# EasyEDA Pro project UWB_&_Sensor_Extension_Board.eprj

# Schematic Schematic1
Board Name: Board1; Create Date: 2026-06-23; Page Name: P1; Project Name: UWB_&_Sensor_Extension_Board; Schematic Name: Schematic1; Update Date: 2026-07-01; Company: EasyEDA.com; Page Size: A4; Version: V1.0
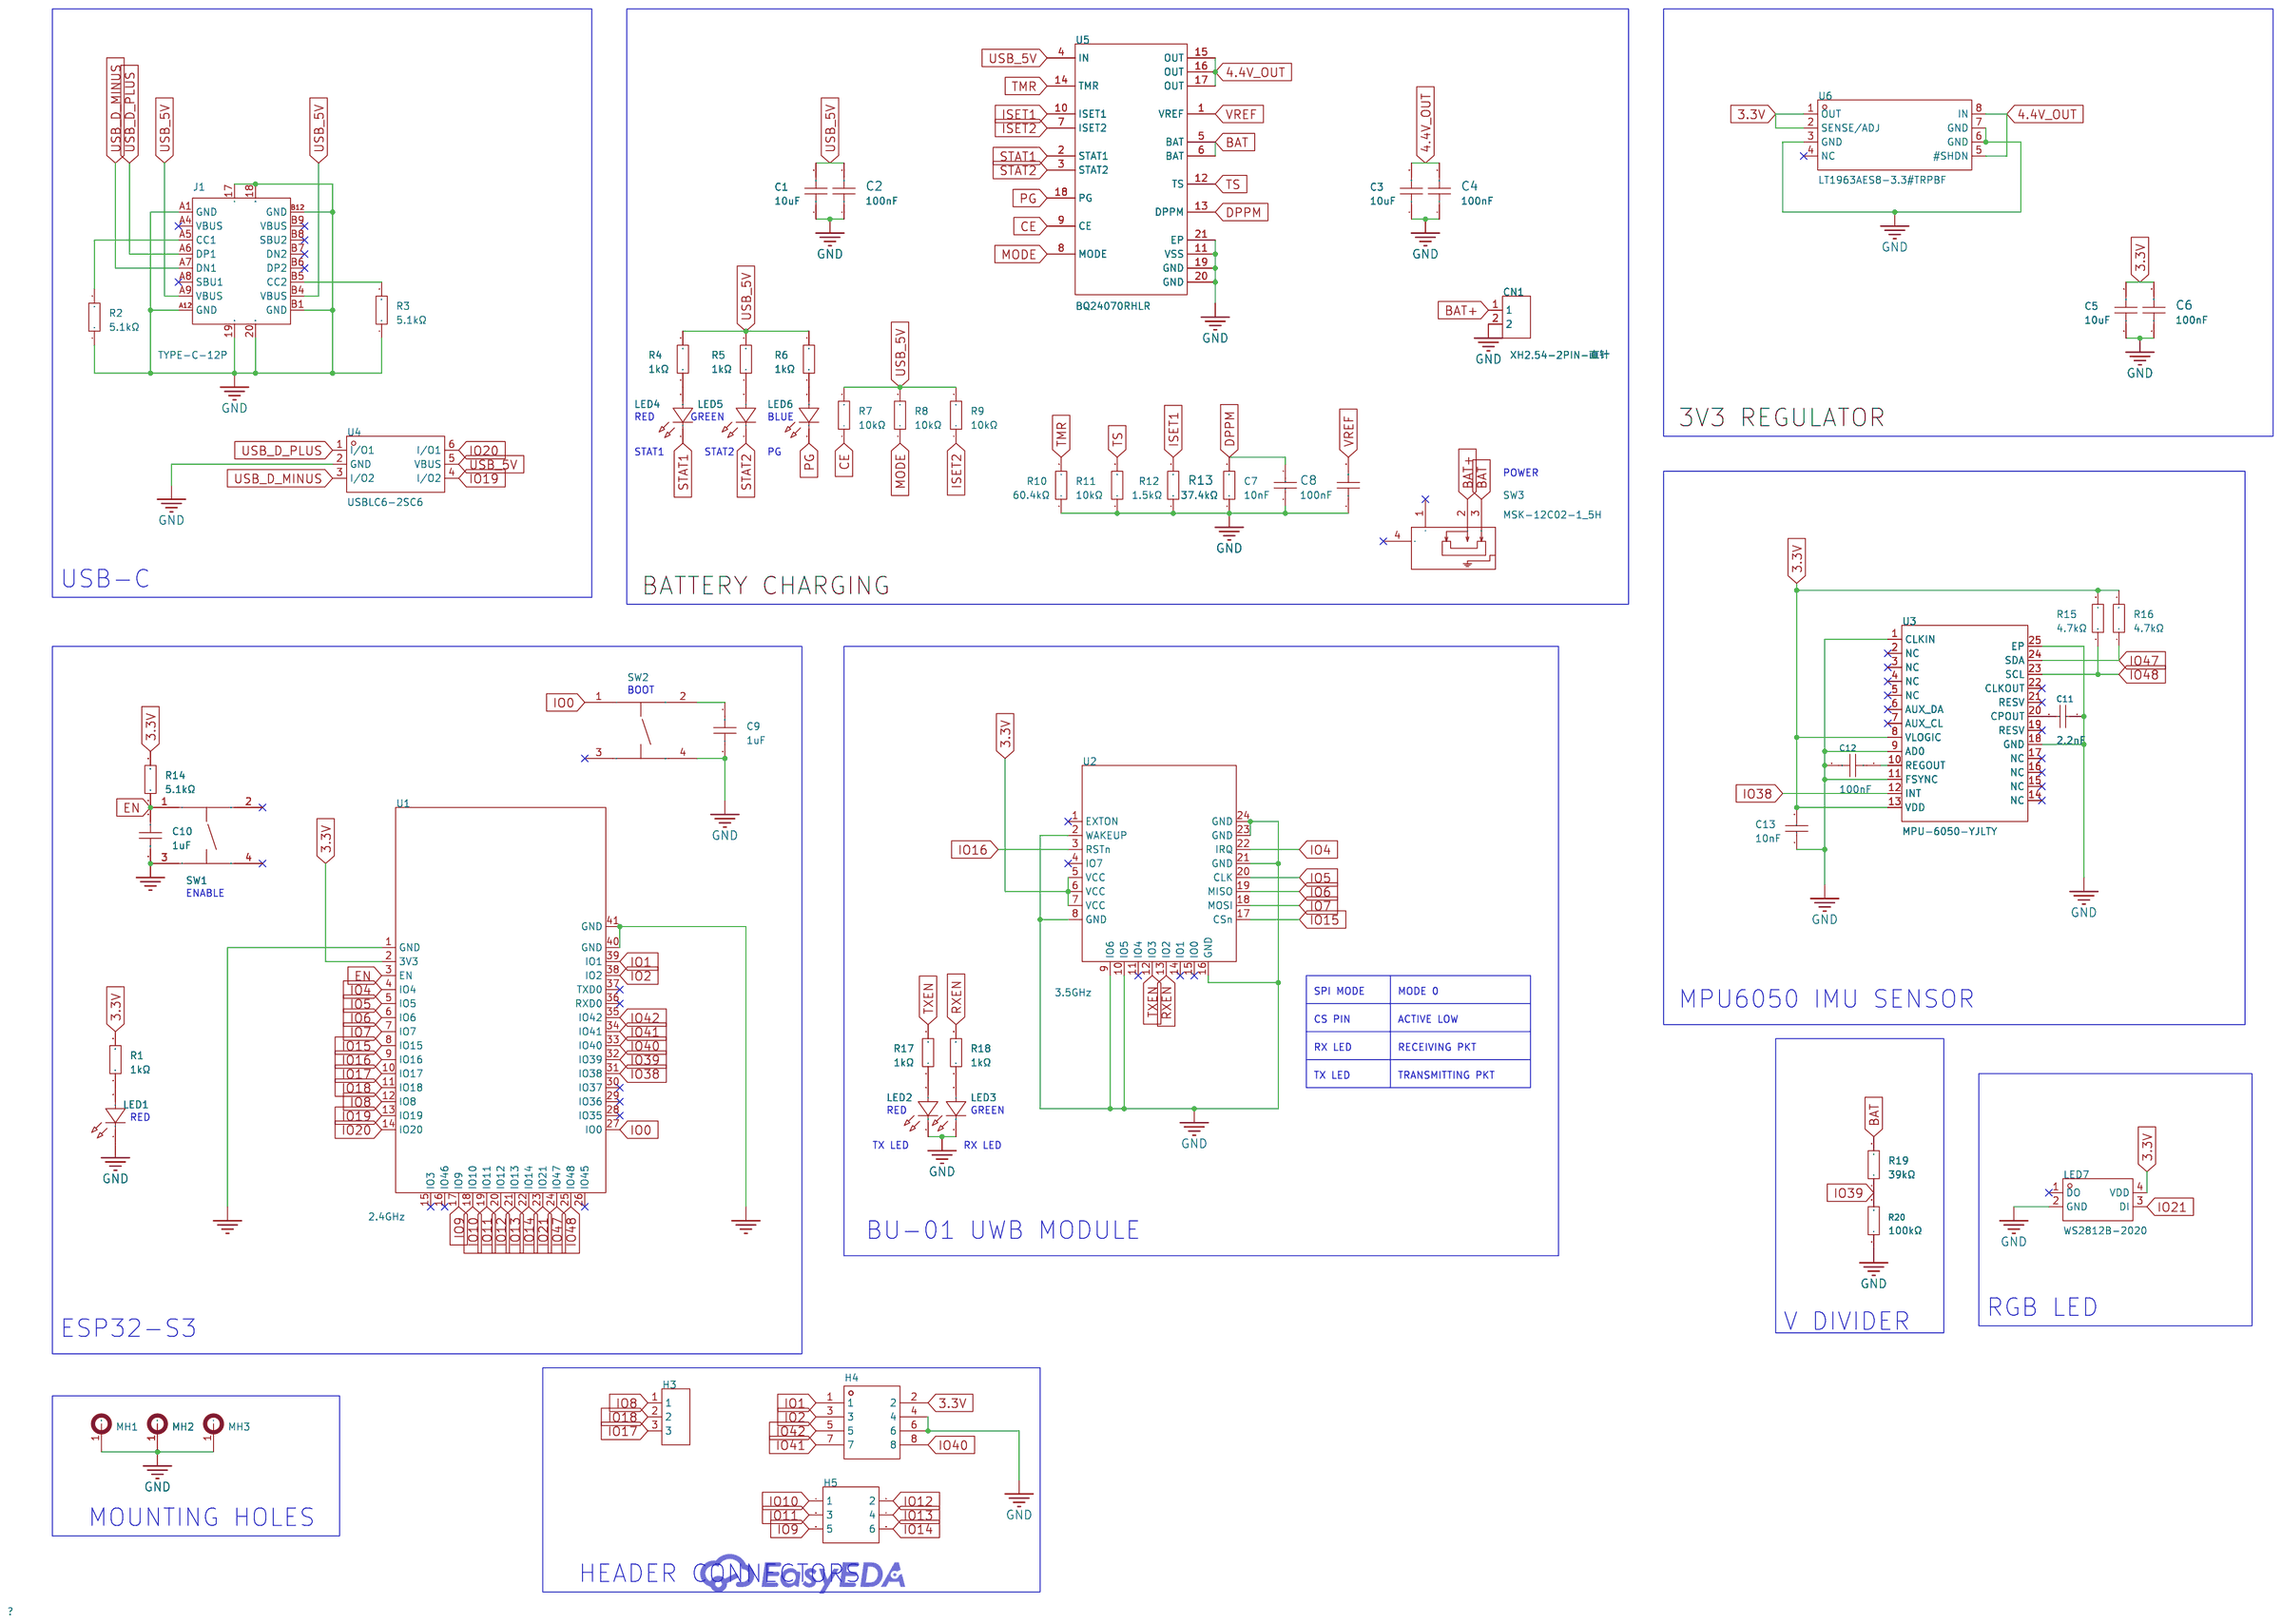
[diagram p0: schematic sheet]

## Parts
C1  10uF  [C0603]
C2  100nF  [C0603]
C3  10uF  [C0603]
C4  100nF  [C0603]
C5  10uF  [C0603]
C6  100nF  [C0603]
C7  10nF  [C0603]
C8  100nF  [C0603]
C9  1uF  [C0603]
C10  1uF  [C0603]
C11  2.2nF  [C0603]
C12  100nF  [C0603]
C13  10nF  [C0603]
CN1  XH2.54-2PIN-直针  [CONN-TH_XH2.54-2P]
H3  -  [HDR-TH_3P-P2.54-V-M]
H4  -  [HDR-TH_8P-P2.54-V-M-R2-C4-S2.54]
H5  -  [HDR-TH_6P-P2.54-V-R2-C3-S2.54_A2541WV-2X3P]
J1  TYPE-C-12P  [USB-SMD_TYPE-C16PIN]
LED1  19-217/GHC-YR1S2/6T  [LED0603-RD_GREEN]
LED2  19-217/GHC-YR1S2/6T  [LED0603-RD_GREEN]
LED3  19-217/GHC-YR1S2/6T  [LED0603-RD_GREEN]
LED4  19-217/GHC-YR1S2/6T  [LED0603-RD_GREEN]
LED5  19-217/GHC-YR1S2/6T  [LED0603-RD_GREEN]
LED6  19-217/GHC-YR1S2/6T  [LED0603-RD_GREEN]
LED7  WS2812B-2020  [LED-SMD_4P-L2.0-W2.0-TL_WS2812B-2020]
MH1  -  [MH_7.5x2.7mm]  (no BOM)
MH2  -  [MH_7.5x2.7mm]  (no BOM)
MH3  -  [MH_7.5x2.7mm]  (no BOM)
R1  1kΩ  [R0603]
R2  5.1kΩ  [R0603]
R3  5.1kΩ  [R0603]
R4  1kΩ  [R0603]
R5  1kΩ  [R0603]
R6  1kΩ  [R0603]
R7  10kΩ  [R0603]
R8  10kΩ  [R0603]
R9  10kΩ  [R0603]
R10  60.4kΩ  [R0603]
R11  10kΩ  [R0603]
R12  1.5kΩ  [R0603]
R13  37.4kΩ  [R0603]
R14  5.1kΩ  [R0603]
R15  4.7kΩ  [R0603]
R16  4.7kΩ  [R0603]
R17  1kΩ  [R0603]
R18  1kΩ  [R0603]
R19  39kΩ  [R0603]
R20  100kΩ  [R0603]
SW1  TS3315A  [SW-SMD_4P-L3.4-W3.4-P2.00-LS4.0]
SW2  TS3315A  [SW-SMD_4P-L3.4-W3.4-P2.00-LS4.0]
SW3  MSK-12C02-1_5H  [SW-TH_MSK12C02]
U1  2.4GHz  [WIRELM-SMD_ESP32-S3-WROOM-1]
U2  3.5GHz  [COMM-SMD_BU01]
U3  MPU-6050-YJLTY  [QFN-24_L4.0-W4.0-P0.50-TL-EP2.7]
U4  USBLC6-2SC6  [SOT-23-6_L2.9-W1.6-P0.95-LS2.8-BL]
U5  BQ24070RHLR  [QFN-20_L4.7-W3.7-P0.50-BL-EP]
U6  LT1963AES8-3.3#TRPBF  [SO-8_L4.9-W3.9-P1.27-LS5.9-BL]

## Library data of the parts
C1 C3 C5 = CL10A106KP8NNNC: Capacitance:10uF Tolerance:±10% Tolerance:±10% Voltage Rating:10V Temperature Coefficient:X5R; LCSC Part Name: 10uF ±10% 10V; Supplier Part: C19702; Manufacturer: SAMSUNG(三星); Supplier Footprint: 0603; JLCPCB Part Class: Basic Part; Datasheet: https://item.szlcsc.com/datasheet/CL10A106KP8NNNC/20411.html; Supplier: LCSC; Tolerance: ±10%; Voltage Rating: 10V; Temperature Coefficient: X5R
C2 C4 C6 C8 C12 = CC0603KRX7R6BB104: Capacitance:100nF Tolerance:±10% Tolerance:±10% Voltage Rating:10V Temperature Coefficient:X7R; LCSC Part Name: 100nF ±10% 10V; Supplier Part: C519438; Manufacturer: YAGEO(国巨); Supplier Footprint: 0603; JLCPCB Part Class: Extended Part; Datasheet: https://item.szlcsc.com/datasheet/CC0603KRX7R6BB104/536109.html; Supplier: LCSC; Tolerance: ±10%; Voltage Rating: 10V; Temperature Coefficient: X7R
C7 C13 = CC0603JRX7R9BB103: LCSC Part Name: 10nF ±5% 50V; Supplier Part: C115056; Manufacturer: YAGEO(国巨); Supplier Footprint: 0603; Datasheet: https://item.szlcsc.com/datasheet/CC0603JRX7R9BB103/116301.html; Supplier: LCSC; Tolerance: ±5%; Voltage Rating: 50V; Temperature Coefficient: X7R
C9 C10 = 0603X105K250CT: Capacitance: Tolerance:±10% Tolerance:±10% Voltage Rated: Temperature Coefficient:; LCSC Part Name: 1uF ±10% 25V; Supplier Part: C303883; Manufacturer: Walsin(华新科); Supplier Footprint: 0603; Supplier: LCSC; Tolerance: ±10%
C11 = CC0603JRNPO9BN222: LCSC Part Name: 2.2nF ±5% 50V; Supplier Part: C107043; Manufacturer: YAGEO(国巨); Supplier Footprint: 0603; JLCPCB Part Class: Extended Part; Datasheet: https://item.szlcsc.com/datasheet/CC0603JRNPO9BN222/108259.html; Supplier: LCSC; Tolerance: ±5%; Voltage Rating: 50V; Temperature Coefficient: NP0
CN1 = XH2.54-2PIN-直针: Supplier Part: C9900011425; Supplier Footprint: XH2.54-2PIN; Supplier: LCSC
H3 = HDR-M_2.54_1x3P: Supplier Footprint: Through
H4 = HDR-M_2.54_2x4: Supplier Footprint: Through
H5 = HDR-M_2.54_2x3: Supplier Footprint: Through
J1 = TYPE-C-12P: Supplier Part: C9900014866; Supplier Footprint: USB_TypeC; JLCPCB Part Class: Extended Part; Supplier: LCSC
LED1-LED6 = 19-217/GHC-YR1S2/6T: Lamp Holder Type:- Illumination Color:Emerald Voltage - Forward(Vf):- Voltage - Forward(Vf):- Power(Watts):- Forward Current:- Wavelength - Dominant:- Wavelength - Dominant:- Peak Wavelength:- Diode Configuration:- Lens Color:- Color Temperature:- Color T; LCSC Part Name: 翠绿; Supplier Part: C2986059; Manufacturer: EVERLIGHT(亿光); Supplier Footprint: 0603; Supplier: LCSC; Illumination Color: Emerald
LED7 = WS2812B-2020: LCSC Part Name: RGB三色 停产; Supplier Part: C965555; Manufacturer: worldsemi; Supplier Footprint: SMD,2.2x2mm; JLCPCB Part Class: Extended Part; Datasheet: https://item.szlcsc.com/datasheet/WS2812B-2020/1051115.html; Supplier: LCSC; Wavelength: G:515.6nm；R:622.5nm；B:470.4nm; Luminous Intensity: 200mcd；160mcd；520mcd; Fixed-Frequency Pwm Mode: 2kHz; Data Transmission Rate: 800Kbit/s; Voltage - Supply: 5V; Installation method: Top-mount; Height: 0.84mm; Features: Built-in power-on reset circuit；Integrated intelligent reverse connection protection function；Built-in power-on reset circuit
MH1-MH3 = MH_7.5x2.7mm
R1 R4-R6 R17 R18 = RC0603FR-071KL: LCSC Part Name: 厚膜电阻 1kΩ ±1% 100mW; Supplier Part: C22548; Manufacturer: YAGEO(国巨); Supplier Footprint: 0603; JLCPCB Part Class: Extended Part; Datasheet: https://item.szlcsc.com/datasheet/RC0603FR-071KL/23274.html; Supplier: LCSC; Type: Thick Film Resistor; Tolerance: ±1%; Power(Watts): 100mW; Voltage-Supply(Max): 75V; Temperature Coefficient: ±100ppm/℃; Operating Temperature: -55℃~+155℃
R2 R3 R14 = RC0603FR-075K1L: Type:Thick Film Resistors Resistance:5.1kΩ Tolerance:±1% Tolerance:±1% Power(Watts):100mW Voltage-Supply(Max):75V Temperature Coefficient:±100ppm/℃ Temperature Coefficient:±100ppm/℃ Operating Temperature:-55℃~+155℃ Operating Temperature:-55℃~+155℃; LCSC Part Name: 厚膜电阻 5.1kΩ ±1% 100mW; Supplier Part: C105580; Manufacturer: YAGEO(国巨); Supplier Footprint: 0603; Datasheet: https://item.szlcsc.com/datasheet/RC0603FR-075K1L/106795.html; Supplier: LCSC; Type: Thick Film Resistors; Tolerance: ±1%; Power(Watts): 100mW; Voltage-Supply(Max): 75V; Temperature Coefficient: ±100ppm/℃; Operating Temperature: -55℃~+155℃
R7-R9 R11 = RC0603FR-0710KL: LCSC Part Name: 厚膜电阻 10kΩ ±1% 100mW; Supplier Part: C98220; Manufacturer: YAGEO(国巨); Supplier Footprint: 0603; JLCPCB Part Class: Extended Part; Datasheet: https://item.szlcsc.com/datasheet/RC0603FR-0710KL/99429.html; Supplier: LCSC; Type: Thick Film Resistor; Tolerance: ±1%; Power(Watts): 100mW; Voltage-Supply(Max): 75V; Temperature Coefficient: ±100ppm/℃; Operating Temperature: -55℃~+155℃
R10 = RC0603FR-0760K4L: LCSC Part Name: 厚膜电阻 60.4kΩ ±1% 100mW; Supplier Part: C165742; Manufacturer: YAGEO(国巨); Supplier Footprint: 0603; Datasheet: https://atta.szlcsc.com/upload/public/pdf/source/20190902/C165742_BA3296AC33DF48BC3358B1B621A03FC2.pdf; Supplier: LCSC; Type: Thick Film Resistors; Tolerance: ±1%; Temperature Coefficient: ±100ppm/℃; Operating Temperature Range: -55℃~+155℃
R12 = RC0603FR-071K5L: LCSC Part Name: 厚膜电阻 1.5kΩ ±1% 100mW; Supplier Part: C114668; Manufacturer: YAGEO(国巨); Supplier Footprint: 0603; JLCPCB Part Class: Extended Part; Datasheet: https://atta.szlcsc.com/upload/public/pdf/source/20180821/C275644_0D56F95EFF785E7D9A1FEF436B37DA78.pdf; Supplier: LCSC; Type: Thick Film Resistors; Tolerance: ±1%; Temperature Coefficient: ±100ppm/℃; Operating Temperature Range: -55℃~+155℃
R13 = 0603WAF3742T5E: LCSC Part Name: 37.4kΩ ±1% 100mW 厚膜电阻; Supplier Part: C23033; Manufacturer: UNI-ROYAL(厚声); Supplier Footprint: 0603; Datasheet: https://item.szlcsc.com/datasheet/0603WAF3742T5E/23760.html; Supplier: LCSC; Type: Thick Film Resistor; Tolerance: ±1%; Power(Watts): 100mW; Voltage-Supply(Max): 75V; Temperature Coefficient: ±100ppm/℃; Operating Temperature: -55℃~+155℃
R15 R16 = RC0603FR-074K7L: LCSC Part Name: 厚膜电阻 4.7kΩ ±1% 100mW; Supplier Part: C99782; Manufacturer: YAGEO(国巨); Supplier Footprint: 0603; Datasheet: https://item.szlcsc.com/datasheet/RC0603FR-074K7L/100996.html; Supplier: LCSC; Type: Thick Film Resistor; Tolerance: ±1%; Power(Watts): 100mW; Voltage-Supply(Max): 75V; Temperature Coefficient: ±100ppm/℃; Operating Temperature: -55℃~+155℃
R19 = RC0603FR-0739KL: LCSC Part Name: 厚膜电阻 39kΩ ±1% 100mW; Supplier Part: C163424; Manufacturer: YAGEO(国巨); Supplier Footprint: 0603; Datasheet: https://atta.szlcsc.com/upload/public/pdf/source/20181009/C309620_DA5935B6E1D48212CB7A533FE518B3C2.pdf; Supplier: LCSC; Type: Thick Film Resistors; Tolerance: ±1%; Temperature Coefficient: ±100ppm/℃; Operating Temperature Range: -55℃~+155℃
R20 = RC0603FR-07100KL: LCSC Part Name: 厚膜电阻 100kΩ ±1% 100mW; Supplier Part: C14675; Manufacturer: YAGEO(国巨); Supplier Footprint: 0603; JLCPCB Part Class: Extended Part; Datasheet: https://atta.szlcsc.com/upload/public/pdf/source/20140324/1457707028752.pdf; Supplier: LCSC; Type: Thick Film Resistors; Tolerance: ±1%; Temperature Coefficient: ±100ppm/℃; Operating Temperature Range: -55℃~+155℃
SW1 SW2 = TS3315A: Circuit:SPST Actuator Style:Round Button Operating Force:2.5N Mounting Type:Surface Mount,Vertical Length:3.3mm Width:3.3mm Switch Height:1.5mm with Bracket:Without Bracket Contact Current:50mA Voltage Rating:12V Actuator/Cap Color:Black With Lamp:No IP R; LCSC Part Name: 3.3*3.3*1.5mm 立贴 轻触开关; Supplier Part: C412367; Manufacturer: SHOU HAN(首韩); Supplier Footprint: SMD,3.3x3.3mm; Datasheet: https://item.szlcsc.com/datasheet/TS3315A/404079.html; Supplier: LCSC; Circuit: SPST; Actuator Style: Round Button; Operating Force: 2.5N; Mounting Type: Surface Mount,Vertical; Length: 3.3mm; Width: 3.3mm; Switch Height: 1.5mm; with Bracket: Without Bracket; Contact Current: 50mA; Voltage Rating: 12V; Actuator/Cap Color: Black; With Lamp: No; Termination Style: SMD(SMT) Tab; Life: 50,000 cycles; Operating Temperature: -20℃~+70℃
SW3 = MSK-12C02-1_5H: Supplier Part: C9900018305; JLCPCB Part Class: Extended Part; Supplier: LCSC
U1 = ESP32-S3-WROOM-1-N16R8: Utilized IC / Part:ESP32-S3R8 Interface Type:I2C；GPIO；UART；SPI；USB；I2S Frequency:2.4GHz Antenna Type:On-board PCB Antenna Output Power:20.5dBm Output Power:20.5dBm Voltage - Supply:3V~3.6V Voltage - Supply:3V~3.6V Receive  Current:95mA Send  Current:355mA; LCSC Part Name: 不带固件 通用型Wi-Fi+低功耗蓝牙MCU模组; Supplier Part: C2913202; Manufacturer: ESPRESSIF(乐鑫); Supplier Footprint: SMD,25.5x18mm; JLCPCB Part Class: Extended Part; Datasheet: https://item.szlcsc.com/datasheet/ESP32-S3-WROOM-1-N16R8/3198300.html; Supplier: LCSC; Utilized IC / Part: ESP32-S3R8; Interface Type: I2C；GPIO；UART；SPI；USB；I2S; Antenna Type: On-board PCB Antenna; Output Power: 20.5dBm; Voltage - Supply: 3V~3.6V; Receive  Current: 95mA; Send  Current: 355mA; Sensitivity: -103.5dBm; Operating Temperature: -40℃~+65℃
U2 = BU01: LCSC Part Name: 停产 UWB模组; Supplier Part: C503604; Manufacturer: Ai-Thinker(安信可); Supplier Footprint: SMD,23x13mm; Datasheet: https://item.szlcsc.com/datasheet/BU01/516251.html; Supplier: LCSC; Model: Transmit; Interface Type: SPI; Voltage - Supply: 3.3V; Antenna Type: On-board PCB Antenna; Operating Temperature: -20℃~+70℃; Features: Integrated antenna；Module reset function
U3 = MPU-6050-YJLTY: Supplier Part: C9900004367; Supplier Footprint: QFN-24-EP(4x4); JLCPCB Part Class: Extended Part; Supplier: LCSC
U4 = USBLC6-2SC6_C2687116: Maximum Clamping Voltage:15V Breakdown Voltage:6V Number of Lines:双路 Type:ESD; Supplier Part: C2687116; Manufacturer: UMW(友台半导体); Supplier Footprint: SOT-23-6; JLCPCB Part Class: Extended Part; Datasheet: https://atta.szlcsc.com/upload/public/pdf/source/20231109/512642D850D9873E7C519F71E85B9A10.pdf; Supplier: LCSC; Maximum Clamping Voltage: 15V; Breakdown Voltage: 6V; Number of Lines: 双路; Type: ESD
U5 = BQ24070RHLR: LCSC Part Name: 单芯片锂离子充电和系统电源路径管理IC; Supplier Part: C6514; Manufacturer: TI(德州仪器); Supplier Footprint: QFN-20-EP(3.7x4.7); JLCPCB Part Class: Extended Part; Datasheet: https://www.ti.com/cn/lit/gpn/bq24070; Supplier: LCSC; The Chip Type: Charging IC; Voltage - Supply: 4.35V~16V; Charge Current - Max: 1.5A; Charging Saturation Voltage: 4.2V; Type of Battery: Lithium Battery; Number of Cells: 1; Operating Temperature: -40℃~+125℃; Battery Temperature Detection: Support; Supply Current (Iq): 1mA
U6 = LT1963AES8-3.3#TRPBF: Supplier Part: C514417; Supplier Footprint: SO-8; JLCPCB Part Class: Extended Part; Supplier: LCSC

## Nets
3.3V: C5.2 C6.2 C13.2 H4.2 LED7.4(VDD) R1.2 R14.2 R15.2 R16.2 U1.2(3V3) U2.5(VCC) U2.6(VCC) U2.7(VCC) U3.8(VLOGIC) U3.13(VDD) U6.1(OUT) U6.2(SENSE/ADJ)
4.4V_OUT: C3.2 C4.2 U5.15(OUT) U5.16(OUT) U5.17(OUT) U6.5(#SHDN) U6.8(IN)
GND: C1.1 C2.1 C3.1 C4.1 C5.1 C6.1 C7.1 C8.1 C9.2 C10.2 C11.2 C12.2 C13.1 CN1.2 H4.4 H4.6 J1.17 J1.18 J1.19 J1.20 J1.A1(GND) J1.A12(GND) J1.B1(GND) J1.B12(GND) LED1.1(K) LED2.1(K) LED3.1(K) LED7.2(GND) MH1.1 MH2.1 MH3.1 R2.1 R3.1 R10.1 R11.1 R12.1 R13.1 R20.1 SW1.3(C) SW2.4(D) U1.1(GND) U1.40(GND) U1.41(GND) U2.2(WAKEUP) U2.8(GND) U2.9(IO6) U2.10(IO5) U2.16(GND) U2.21(GND) U2.23(GND) U2.24(GND) U3.1(CLKIN) U3.9(AD0) U3.11(FSYNC) U3.18(GND) U3.25(EP) U4.2(GND) U5.11(VSS) U5.19(GND) U5.20(GND) U5.21(EP) U6.3(GND) U6.6(GND) U6.7(GND)
BAT: R19.2 SW3.3 U5.5(BAT) U5.6(BAT)
BAT+: CN1.1 SW3.2
CE: R7.1 U5.9(CE)
DPPM: C7.2 R13.2 U5.13(DPPM)
EN: C10.1 R14.1 SW1.1(A) U1.3(EN)
IO0: SW2.1(A) U1.27(IO0)
IO1: H4.1 U1.39(IO1)
IO2: H4.3 U1.38(IO2)
IO4: U1.4(IO4) U2.22(IRQ)
IO5: U1.5(IO5) U2.20(CLK)
IO6: U1.6(IO6) U2.19(MISO)
IO7: U1.7(IO7) U2.18(MOSI)
IO8: H3.1 U1.12(IO8)
IO9: H5.5 U1.17(IO9)
IO10: H5.1 U1.18(IO10)
IO11: H5.3 U1.19(IO11)
IO12: H5.2 U1.20(IO12)
IO13: H5.4 U1.21(IO13)
IO14: H5.6 U1.22(IO14)
IO15: U1.8(IO15) U2.17(CSn)
IO16: U1.9(IO16) U2.3(RSTn)
IO17: H3.3 U1.10(IO17)
IO18: H3.2 U1.11(IO18)
IO19: U1.13(IO19) U4.4(I/O2)
IO20: U1.14(IO20) U4.6(I/O1)
IO21: LED7.3(DI) U1.23(IO21)
IO38: U1.31(IO38) U3.12(INT)
IO39: R19.1 R20.2 U1.32(IO39)
IO40: H4.8 U1.33(IO40)
IO41: H4.7 U1.34(IO41)
IO42: H4.5 U1.35(IO42)
IO47: R16.1 U1.24(IO47) U3.24(SDA)
IO48: R15.1 U1.25(IO48) U3.23(SCL)
ISET1: R12.2 U5.10(ISET1)
ISET2: R9.1 U5.7(ISET2)
MODE: R8.1 U5.8(MODE)
PG: LED6.1(K) U5.18(PG)
RXEN: R18.2 U2.13(IO2)
STAT1: LED4.1(K) U5.2(STAT1)
STAT2: LED5.1(K) U5.3(STAT2)
TMR: R10.2 U5.14(TMR)
TS: R11.2 U5.12(TS)
TXEN: R17.2 U2.12(IO3)
USB_5V: C1.2 C2.2 J1.A9(VBUS) J1.B4(VBUS) R4.2 R5.2 R6.2 R7.2 R8.2 R9.2 U4.5(VBUS) U5.4(IN)
USB_D_MINUS: J1.A7(DN1) U4.3(I/O2)
USB_D_PLUS: J1.A6(DP1) U4.1(I/O1)
VREF: C8.2 U5.1(VREF)
$1N926: C9.1 SW2.2(B)
$1N1418: J1.A5(CC1) R2.2
$1N1428: J1.B5(CC2) R3.2
$1N6564: LED6.2(A) R6.1
$1N6603: LED5.2(A) R5.1
$1N6642: LED4.2(A) R4.1
$1N10209: LED3.2(A) R18.1
$1N10210: LED2.2(A) R17.1
$1N12425: C12.1 U3.10(REGOUT)
$1N12673: C11.1 U3.20(CPOUT)
$1N15457: LED1.2(A) R1.1

Not connected (* = marked no-connect by the designer): J1 A4(VBUS)* A8(SBU1)* B6(DP2)* B7(DN2)* B8(SBU2)* B9(VBUS)*; LED7 1(DO)*; SW1 2(B)* 4(D)*; SW2 3(C)*; SW3 1* 4*; U1 15(IO3)* 16(IO46)* 26(IO45)* 28(IO35)* 29(IO36)* 30(IO37)* 36(RXD0)* 37(TXD0)*; U2 1(EXTON)* 4(IO7)* 11(IO4)* 14(IO1)* 15(IO0)*; U3 2(NC)* 3(NC)* 4(NC)* 5(NC)* 6(AUX_DA)* 7(AUX_CL)* 14(NC)* 15(NC)* 16(NC)* 17(NC)* 19(RESV)* 21(RESV)* 22(CLKOUT)*; U6 4(NC)*

## Notes on the sheet
- RED
- GREEN
- BLUE
- 3V3 REGULATOR
- STAT1
- STAT2
- PG
- POWER
- USB-C
- BATTERY CHARGING
- BOOT
- ENABLE
- SPI MODE
- MODE 0
- CS PIN
- ACTIVE LOW
- MPU6050 IMU SENSOR
- RX LED
- RECEIVING PKT
- TX LED
- TRANSMITTING PKT
- RED
- RED
- GREEN
- TX LED
- RX LED
- BU-01 UWB MODULE
- RGB LED
- ESP32-S3
- V DIVIDER
- MOUNTING HOLES
- HEADER CONNECTORS

# Board PCB1
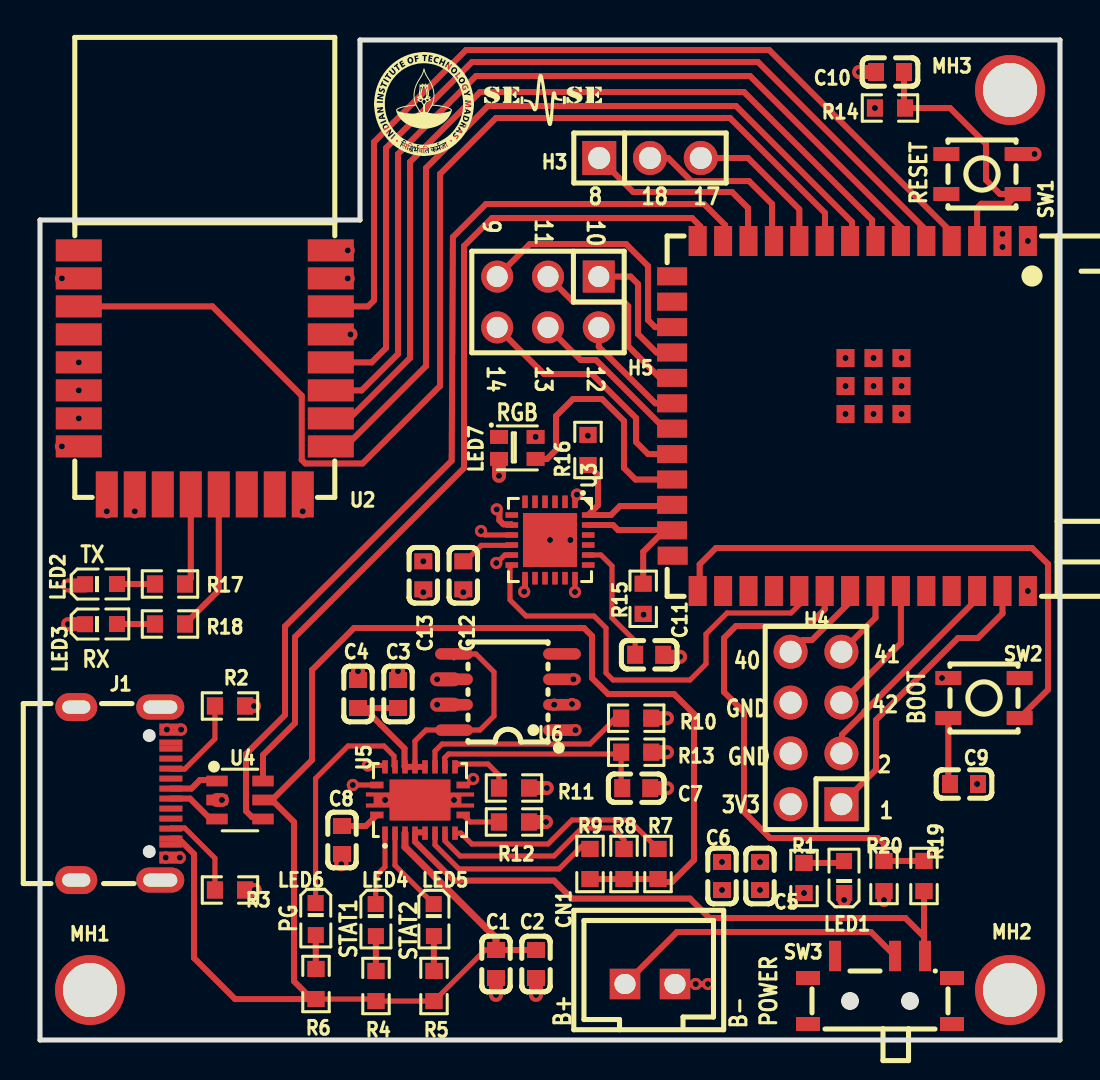
[diagram p1: board, top side]
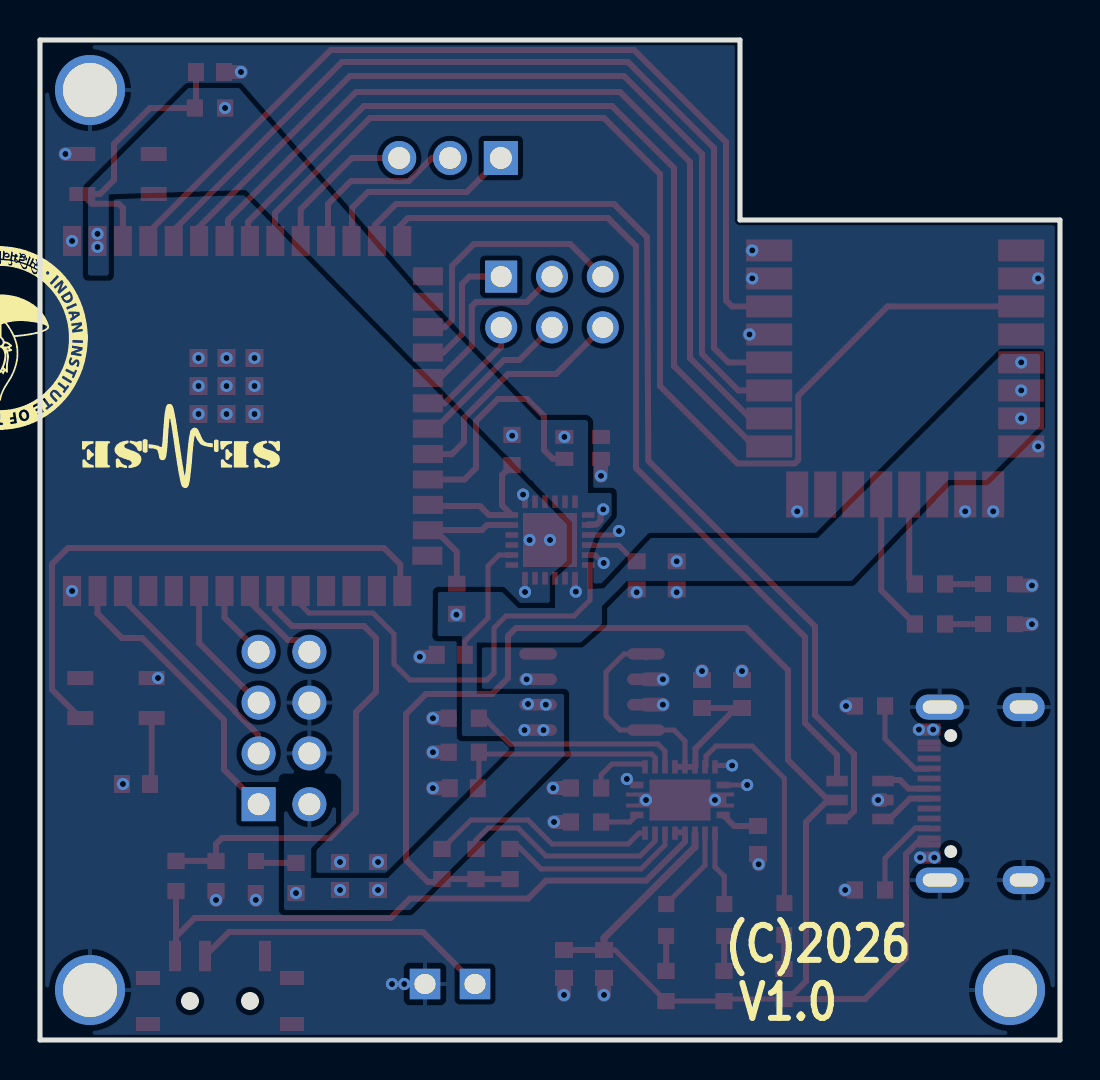
[diagram p2: board, bottom side, seen from below]

Outline 51 x 50 mm; copper layers: Top Layer, Bottom Layer. Coordinates in mm from the lower left corner of the outline.
Outline path: 0,41 0,0 51,0 51,50 16,50 16,41 0,41
Stack: Top Layer 0.035mm / Dielectric1 1.51mm FR4 er 4.5 / Bottom Layer 0.035mm

## Design rules (mm)
template: Custom Config
spacing copperThickness1oz (default): track to track 0.127, other pairs 0.152 to 0.3
spacing copperThickness2oz: track to track 0.203, other pairs 0.152 to 0.3
track width copperThickness1oz (default): min 0.127, default 0.254, max 2.54
track width copperThickness2oz: min 0.203, default 0.254, max 2.54
differential pair differentialPair (default): width min 0.127, default 0.254, max 2.54; gap min 0.152, default 0.152
via viaSize (default): diameter min 0.5, default 0.61, max 10; hole min 0.3, default 0.305, max 6.3

## Placement (name value [footprint] x y rotation side)
C1  10uF  [C0603]  22.8 3.8 90 top
C2  100nF  [C0603]  24.8 3.8 90 top
C3  10uF  [C0603]  17.9 17.3 270 top
C4  100nF  [C0603]  15.9 17.3 270 top
C5  10uF  [C0603]  36 8.2 270 top
C6  100nF  [C0603]  34.1 8.2 270 top
C7  10nF  [C0603]  29.81 12.59 180 top
C8  100nF  [C0603]  15.1 10 90 top
C9  1uF  [C0603]  46.2 12.8 0 top
C10  1uF  [C0603]  42.5 48.4 180 top
C11  2.2nF  [C0603]  30.46 19.26 0 top
C12  100nF  [C0603]  21.16 23.23 270 top
C13  10nF  [C0603]  19.16 23.23 90 top
CN1  XH2.54-2PIN-直针  [CONN-TH_XH2.54-2P]  30.5 2.8 0 top
H3  -  [HDR-TH_3P-P2.54-V-M]  30.5 44.1 0 top
H4  -  [HDR-TH_8P-P2.54-V-M-R2-C4-S2.54]  38.8 15.6 90 top
H5  -  [HDR-TH_6P-P2.54-V-R2-C3-S2.54_A2541WV-2X3P]  25.4 36.9 180 top
J1  TYPE-C-12P  [USB-SMD_TYPE-C16PIN]  4.18 12.32 270 top
LED1  19-217/GHC-YR1S2/6T  [LED0603-RD_GREEN]  40.21 8.15 90 top
LED2  19-217/GHC-YR1S2/6T  [LED0603-RD_GREEN]  3.05 22.79 0 top
LED3  19-217/GHC-YR1S2/6T  [LED0603-RD_GREEN]  3.05 20.79 0 top
LED4  19-217/GHC-YR1S2/6T  [LED0603-RD_GREEN]  16.79 6 270 top
LED5  19-217/GHC-YR1S2/6T  [LED0603-RD_GREEN]  19.69 6 270 top
LED6  19-217/GHC-YR1S2/6T  [LED0603-RD_GREEN]  13.78 6.05 270 top
LED7  WS2812B-2020  [LED-SMD_4P-L2.0-W2.0-TL_WS2812B-2020]  23.87 29.6 0 top
MH1  -  [MH_7.5x2.7mm]  2.5 2.5 0 top
MH2  -  [MH_7.5x2.7mm]  48.5 2.5 0 top
MH3  -  [MH_7.5x2.7mm]  48.5 47.5 0 top
R1  1kΩ  [R0603]  38.2 8.1 270 top
R2  5.1kΩ  [R0603]  9.5 16.7 180 top
R3  5.1kΩ  [R0603]  9.5 7.5 180 top
R4  1kΩ  [R0603]  16.8 2.7 270 top
R5  1kΩ  [R0603]  19.7 2.7 270 top
R6  1kΩ  [R0603]  13.8 2.8 270 top
R7  10kΩ  [R0603]  30.9 8.8 270 top
R8  10kΩ  [R0603]  29.2 8.8 270 top
R9  10kΩ  [R0603]  27.5 8.8 270 top
R10  60.4kΩ  [R0603]  29.81 16.09 180 top
R11  10kΩ  [R0603]  23.7 12.6 180 top
R12  1.5kΩ  [R0603]  23.7 10.9 180 top
R13  37.4kΩ  [R0603]  29.81 14.39 180 top
R14  5.1kΩ  [R0603]  42.5 46.6 180 top
R15  4.7kΩ  [R0603]  30.16 22.06 270 top
R16  4.7kΩ  [R0603]  27.4 29.5 90 top
R17  1kΩ  [R0603]  6.5 22.8 0 top
R18  1kΩ  [R0603]  6.5 20.8 0 top
R19  39kΩ  [R0603]  44.2 8.2 270 top
R20  100kΩ  [R0603]  42.2 8.2 90 top
SW1  TS3315A  [SW-SMD_4P-L3.4-W3.4-P2.00-LS4.0]  47.1 43.3 180 top
SW2  TS3315A  [SW-SMD_4P-L3.4-W3.4-P2.00-LS4.0]  47.2 17.1 180 top
SW3  MSK-12C02-1_5H  [SW-TH_MSK12C02]  42 2.5 0 top
U1  2.4GHz  [WIRELM-SMD_ESP32-S3-WROOM-1]  40.5 31.2 270 top
U2  3.5GHz  [COMM-SMD_BU01]  8.24 33.38 0 top
U3  MPU-6050-YJLTY  [QFN-24_L4.0-W4.0-P0.50-TL-EP2.7]  25.5 25 270 top
U4  USBLC6-2SC6  [SOT-23-6_L2.9-W1.6-P0.95-LS2.8-BL]  10 12 270 top
U5  BQ24070RHLR  [QFN-20_L4.7-W3.7-P0.50-BL-EP]  19 12 0 top
U6  LT1963AES8-3.3#TRPBF  [SO-8_L4.9-W3.9-P1.27-LS5.9-BL]  23.4 17.4 90 top

## Footprints (pads in the part's own frame, mm; a bottom-side part is the same pattern mirrored in y, then rotated)
C0603
  rect 0.8x0.9 smd: 1(-0.7,0) 2(0.7,0)
COMM-SMD_BU01
  rect 2.3x1.1 smd: 1(-6.3,6.1) 2(-6.3,4.7) 3(-6.3,3.3) 4(-6.3,1.9) 5(-6.3,0.5) 6(-6.3,-0.9) 7(-6.3,-2.3) 8(-6.3,-3.7) 17(6.3,-3.7) 18(6.3,-2.3) 19(6.3,-0.9) 20(6.3,0.5) 21(6.3,1.9) 22(6.3,3.3) 23(6.3,4.7) 24(6.3,6.1)
  rect 1.1x2.3 smd: 9(-4.9,-6.1) 10(-3.5,-6.1) 11(-2.1,-6.1) 12(-0.7,-6.1) 13(0.7,-6.1) 14(2.1,-6.1) 15(3.5,-6.1) 16(4.9,-6.1)
CONN-TH_XH2.54-2P
  rect 1.524x1.524 hole 1.05x1: 1(-1.25,0) 2(1.25,0)
HDR-TH_3P-P2.54-V-M
  rect 1.7x1.7 hole 1.1: 1(-2.54,0)
  round 1.7 hole 1.1: 2(0,0) 3(2.54,0)
HDR-TH_6P-P2.54-V-R2-C3-S2.54_A2541WV-2X3P
  rect 1.6x1.6 hole 1.05: 1(-2.54,-1.27)
  round 1.6 hole 1.05: 2(-2.54,1.27) 3(0,-1.27) 4(0,1.27) 5(2.54,-1.27) 6(2.54,1.27)
HDR-TH_8P-P2.54-V-M-R2-C4-S2.54
  rect 1.7x1.7 hole 1.1: 1(-3.81,-1.27)
  round 1.7 hole 1.1: 2(-3.81,1.27) 3(-1.27,-1.27) 4(-1.27,1.27) 5(1.27,-1.27) 6(1.27,1.27) 7(3.81,-1.27) 8(3.81,1.27)
LED0603-RD_GREEN
  rect 0.8x0.8 smd: 1(-0.799,-0.004) 2(0.799,0.004)
LED-SMD_4P-L2.0-W2.0-TL_WS2812B-2020
  rect 0.9x0.7 smd: 1(-0.915,0.55) 2(-0.915,-0.55) 3(0.915,-0.55) 4(0.915,0.55)
MH_7.5x2.7mm
  round 3.5 hole 2.7: 1(0,0)
QFN-20_L4.7-W3.7-P0.50-BL-EP
  rect 0.665x0.336 smd: 1(-2.158,-0.75) 10(2.158,-0.75) 11(2.158,0.75) 20(-2.158,0.75)
  rect 0.28x0.665 smd: 2(-1.75,-1.657) 3(-1.25,-1.657) 4(-0.75,-1.657) 5(-0.25,-1.657) 6(0.25,-1.657) 7(0.75,-1.657) 8(1.25,-1.657) 9(1.75,-1.657) 12(1.75,1.657) 13(1.25,1.657) 14(0.75,1.657) 15(0.25,1.657) 16(-0.25,1.657) 17(-0.75,1.657) 18(-1.25,1.657) 19(-1.75,1.657)
  custom 5.41x2.05 smd: 21(0,0)
QFN-24_L4.0-W4.0-P0.50-TL-EP2.7
  rect 0.633x0.28 smd: 1(-1.911,1.25) 2(-1.911,0.75) 3(-1.911,0.25) 4(-1.911,-0.25) 5(-1.911,-0.75) 6(-1.911,-1.25) 13(1.911,-1.25) 14(1.911,-0.75) 15(1.911,-0.25) 16(1.911,0.25) 17(1.911,0.75) 18(1.911,1.25)
  rect 0.28x0.633 smd: 7(-1.25,-1.911) 8(-0.75,-1.911) 9(-0.25,-1.911) 10(0.25,-1.911) 11(0.75,-1.911) 12(1.25,-1.911) 19(1.25,1.911) 20(0.75,1.911) 21(0.25,1.911) 22(-0.25,1.911) 23(-0.75,1.911) 24(-1.25,1.911)
  rect 2.7x2.7 smd: 25(0,0)
R0603
  rect 0.806x0.864 smd: 1(-0.753,0) 2(0.753,0)
SO-8_L4.9-W3.9-P1.27-LS5.9-BL
  oval 0.574x1.888 smd: 1(-1.905,-2.699) 2(-0.635,-2.699) 3(0.635,-2.699) 4(1.905,-2.699) 5(1.905,2.699) 6(0.635,2.699) 7(-0.635,2.699) 8(-1.905,2.699)
SOT-23-6_L2.9-W1.6-P0.95-LS2.8-BL
  rect 0.532x1.072 smd: 1(-0.95,-1.149) 2(0,-1.149) 3(0.95,-1.149) 4(0.95,1.149) 5(0,1.149) 6(-0.95,1.149)
SW-SMD_4P-L3.4-W3.4-P2.00-LS4.0
  rect 1.3x0.7 smd: 1(-1.782,1) 2(1.782,1) 3(-1.782,-1) 4(1.782,-1)
SW-TH_MSK12C02
  rect 0.6x1.524 smd: 1(-2.25,1.7) 2(0.75,1.7) 3(2.25,1.7)
  rect 1.2x0.7 smd: 4(-3.6,0.6) 4(-3.6,-1.7) 4(3.6,0.6) 4(3.6,-1.7)
USB-SMD_TYPE-C16PIN
  oval 1.25x2.4 hole 0.65x1.7: 17(-4.325,1.835) 18(4.325,1.835)
  oval 1.4x2.1 hole 0.65x1.4: 19(-4.325,-2.365) 20(4.325,-2.365)
  rect 0.3x1.15 smd: A1(-3.35,2.365) A4(-2.55,2.365) A5(-1.25,2.365) A6(-0.25,2.365) A7(0.25,2.365) A8(1.25,2.365) A9(2.55,2.365) A12(3.35,2.365) B1(3.05,2.365) B4(2.25,2.365) B5(1.75,2.365) B6(0.75,2.365) B7(-0.75,2.365) B8(-1.75,2.365) B9(-2.25,2.365) B12(-3.05,2.365)
WIRELM-SMD_ESP32-S3-WROOM-1
  rect 1.5x0.9 smd: 1(-8.75,8.895) 2(-8.75,7.625) 3(-8.75,6.355) 4(-8.75,5.085) 5(-8.75,3.815) 6(-8.75,2.545) 7(-8.75,1.275) 8(-8.75,0.005) 9(-8.75,-1.265) 10(-8.75,-2.535) 11(-8.75,-3.805) 12(-8.75,-5.075) 13(-8.75,-6.345) 14(-8.75,-7.615) 27(8.75,-7.615) 28(8.75,-6.345) 29(8.75,-5.075) 30(8.75,-3.805) 31(8.75,-2.535) 32(8.75,-1.265) 33(8.75,0.005) 34(8.75,1.275) 35(8.75,2.545) 36(8.75,3.815) 37(8.75,5.085) 38(8.75,6.355) 39(8.75,7.625) 40(8.75,8.895)
  rect 0.9x1.5 smd: 15(-6.985,-8.895) 16(-5.715,-8.895) 17(-4.445,-8.895) 18(-3.175,-8.895) 19(-1.905,-8.895) 20(-0.635,-8.895) 21(0.635,-8.895) 22(1.905,-8.895) 23(3.175,-8.895) 24(4.445,-8.895) 25(5.715,-8.895) 26(6.985,-8.865)
  rect 0.9x0.9 smd: 41(-2.9,2.575) 41(-2.9,1.175) 41(-2.9,-0.225) 41(-1.5,2.575) 41(-1.5,1.175) 41(-1.5,-0.225) 41(-0.1,2.575) 41(-0.1,1.175) 41(-0.1,-0.225)

## Nets
As in the schematic.

Pads without a net: J1 A4 A8 B6 B7 B8 B9; LED7 1; SW1 2 4; SW2 3; SW3 1 4; U1 15 16 26 28 29 30 36 37; U2 1 4 11 14 15; U3 2 3 4 5 6 7 14 15 16 17 19 21 22; U6 4

## Via types
v1: diameter 0.61, hole 0.305, Top Layer to Bottom Layer, 85 vias

## Routing (per net, layer and track width the routed paths; a pad name or vN(x,y) marks a point on that pad's centre or on a via; arc(x,y) is an arc through that point)
3.3V: length 2
  Top Layer w0.3: U3.8 23.59,25.76 23.56,25.78 23.17,25.78 22.97,25.98 22.97,26.4 v1(22.84,26.53) ; v1(24.21,22.42) 24.25,22.46 U3.13
  vias: v1(1.94,33.88) v1(1.94,32.48) v1(1.94,31.08) v1(19.16,23.94) v1(24.78,30.15) v1(25.71,16.77) v1(25.82,15.5) v1(26.6,16.8) v1(26.77,15.5) v1(27.39,30.22) v1(30.18,21.27) v1(34.1,7.5) v1(36,7.5) v1(38.2,7.35) v1(41.75,46.6) v1(48.12,40.31) v1(48.12,39.65)
4.4V_OUT: length 17.2
  Top Layer w0.254: U5.16 18.75,14.95 19.3,15.5 22,15.5 22.7,16.2 22.7,18.4 21.8,19.3 20.9,19.3 20.7,19.11
  Top Layer w0.3: C4.2 16.2,16.6 ; 16.2,16.6 18.23,14.57 18.23,13.68 U5.17 U5.16 U5.15 ; 16.2,16.6 C3.2
GND: length 32.2
  Top Layer w0.254: v1(22.81,23.85) 22.84,23.85 23.24,24.25 U3.11 ; v1(7.06,15.52) 6.91,15.37 J1.B12 ; U6.3 v1(26.67,18.03) ; U3.1 26.75,27.16 26.85,27.26 v1(26.85,27.27) ; v1(21.66,13.05) 21.36,12.75 U5.11 ; U3.18 v1(26.75,22.4) ; v1(6.99,9.12) v1(6.28,9.12) ; U5.19 17.18,13.73 v1(16.4,13.73) ; v1(22.05,25.45) 22.25,25.25 U3.9 ; v1(15.64,12.75) U5.20
  Top Layer w0.3: CN1.2 v1(32.79,2.8) v1(33.4,2.8)
  Top Layer w0.7: LED7.2 v1(22.95,28.21) ; R12.1 v1(25.3,10.9) ; 21.16,22.53 v1(21.16,22.39) ; C7.1 v1(31.36,12.59) ; 31.16,19.16 v1(32.01,19.16) ; C3.1 v1(17.9,18.45) ; v1(49.73,44.3) SW1.3 ; 10.4,7.5 v1(10.74,7.5) ; R20.1 v1(42.2,7) ; LED3.1 v1(1.4,20.79) ; C10.2 v1(40.95,48.4) ; U6.7 v1(19.85,16.77) ; U2.9 v1(3.34,26.43) ; U2.16 v1(13.14,26.43) ; 24.5,12.6 v1(25.34,12.6) ; U6.6 v1(19.85,18.03) ; C4.1 v1(15.9,18.45) ; 30.51,14.39 v1(31.35,14.39) ; 10.35,16.7 v1(10.7,16.7) ; 2.25,22.73 v1(1.4,22.73) ; 15.28,35.28 v1(15.53,35.28) ; U2.23 v1(15.39,38.08) ; C2.1 v1(24.8,2.25) ; U2.8 v1(1.09,29.68) ; C1.1 v1(22.8,2.25) ; 19.16,22.53 v1(19.16,22.39) ; v1(15.07,8.79) 15.07,9.33 ; U2.2 v1(1.09,38.08) ; 30.51,16.09 v1(31.35,16.09) ; U4.2 v1(9.1,12) ; U2.24 v1(15.39,39.48) ; LED1.1 v1(40.21,7) ; U2.10 v1(4.74,26.43)
  vias: v1(6.34,15.52) v1(17.25,12) v1(20.7,12) v1(25.5,25) v1(26.52,25) v1(34.1,8.9) v1(36,8.9) v1(40.28,34.1) v1(40.28,32.7) v1(40.28,31.3) v1(41.68,34.1) v1(41.68,32.7) v1(41.68,31.3) v1(43.07,34.1) v1(43.07,32.7) v1(43.07,31.3) v1(45.1,18.1) v1(46.85,12.8) v1(49.4,39.95) v1(49.4,22.45)
BAT: length 31.6
  Top Layer w0.3: U5.6 19.21,10.38 18.79,10.38 U5.5 18.75,9.92 20.7,7.97 25.7,7.97 26.6,7.07 32.5,7.07 33.47,6.1 43.27,6.1 44.2,5.17 ; R19.2 44.2,5.17 ; 44.2,5.17 44.2,4.64 44.25,4.59 SW3.3
BAT+: length 15.1
  Top Layer w0.3: SW3.2 41.55,5.4 31.85,5.4 CN1.1
CE: length 11.5
  Top Layer w0.254: R7.1 29.45,11 26.6,11 25.4,9.8 21.59,9.8 21.05,10.34 U5.9
DPPM: length 11.3
  Top Layer w0.254: R13.2 29.06,14.11 ; 29.06,14.11 29.06,12.64 C7.2 ; 29.06,14.11 28.87,14.3 20.43,14.3 20.23,14.11 20.23,13.68 U5.13
EN: length 14.3
  Top Layer w0.3: U1.3 46.85,41.6 47.07,41.81 48.39,41.81 SW1.1 48,42.3 47.3,43 47.3,44.8 45.5,46.6 R14.1 43.2,46.65 C10.1
IO0: length 27.7
  Top Layer w0.3: U1.27 32.99,22.55 32.99,23.78 33.8,24.6 49.6,24.6 50.4,23.8 50.4,17.52 SW2.1
IO1: length 14.6
  Top Layer w0.3: U1.39 48.12,21.33 46.9,20.1 45.9,20.1 41.8,16 41.8,13.52 H4.1
IO2: length 10.9
  Top Layer w0.3: U1.38 46.85,22.06 41.22,16.42 41.22,16.39 40.1,15.27 40.1,14.36 H4.3
IO4: length 45.2
  Top Layer w0.3: U2.22 16.4,36.68 16.7,36.98 16.7,44.9 21.3,49.5 36.46,49.5 45.59,40.37 U1.4
IO5: length 45.9
  Top Layer w0.3: U1.5 44.3,39.97 44.3,40.5 35.9,48.9 21.6,48.9 17.3,44.6 17.3,34.6 16.58,33.88 U2.20
IO6: length 44.8
  Top Layer w0.3: U2.19 16.08,32.48 17.9,34.3 17.9,44.3 21.8,48.2 35.5,48.2 43.1,40.6 43.1,40 U1.6
IO7: length 43.4
  Top Layer w0.3: U2.18 15.48,31.08 18.5,34.1 18.5,43.9 22,47.4 35.2,47.4 41.6,41 41.6,40.03 41.68,39.95 U1.7
IO8: length 10.1
  Top Layer w0.3: U1.12 35.4,39.97 35.4,41.6 34.6,42.4 29.66,42.4 H3.1
IO9: length 12.7
  Top Layer w0.3: 31.6,35.64 30.75,35.64 30.4,36 30.4,38.7 29.3,39.8 24.49,39.8 H5.5
IO10: length 6.7
  Top Layer w0.3: H5.1 29.53,38.17 29.9,37.8 29.9,35.3 30.82,34.38 U1.18
IO11: length 9.5
  Top Layer w0.3: U1.19 31,33.11 29.41,34.69 29.41,36.69 29.2,36.9 26.67,36.9 H5.3
IO12: length 5.8
  Top Layer w0.3: H5.2 27.94,34.66 30.76,31.83 U1.20
IO13: length 8.3
  Top Layer w0.3: H5.4 27.03,34 27.8,34 31.24,30.56 U1.21
IO14: length 12.1
  Top Layer w0.3: H5.6 24.89,33.6 24.9,33.6 25.2,33.3 27.6,33.3 29.8,31.1 29.8,29.9 30.41,29.3 U1.22
IO15: length 42.3
  Top Layer w0.3: U2.17 15.28,29.68 19.3,33.7 19.3,43.6 22.4,46.7 34.8,46.7 40.6,40.9 40.6,40.05 U1.8
IO16: length 59.2
  Top Layer w0.3: U2.3 8.62,36.68 13.09,32.21 13.09,29 13.26,28.83 16.13,28.83 20,32.7 20,43.3 22.8,46.1 34.5,46.1 39.25,41.35 39.25,39.97 U1.9
IO17: length 7.6
  Top Layer w0.3: U1.10 37.97,41.53 35.4,44.1 H3.3
IO18: length 8.9
  Top Layer w0.3: U1.11 36.6,40.05 36.6,41.8 35.45,42.95 32.56,42.95 31.41,44.1 H3.2
IO19: length 49.6
  Top Layer w0.3: U1.13 34.25,40.05 34.25,40.75 33.2,41.8 22.3,41.8 20.65,40.15 20.58,28.96 12.25,20.68 12.25,16.25 10.3,14.3 10.3,11.45 10.6,11.15 11.05,11.15 U4.4
IO20: length 44.3
  Top Layer w0.3: U1.14 33.01,40.08 33.01,40.69 32.6,41.1 22.6,41.1 21.2,39.7 21.2,28.6 12.75,20.15 12.75,15.85 11.15,14.25 U4.6
IO21: length 12.1
  Top Layer w0.3: LED7.3 25.35,29.05 25.8,29.5 25.8,31.2 26.65,32.05 28.1,32.05 29.2,30.95 29.2,28.6 29.78,28.03 U1.23
IO38: length 22.3
  Top Layer w0.254: U3.12 23.5,23.66 23.5,22 24.3,21.2 27.7,21.2 28.3,20.6 28.3,18.35 28.65,18 32.5,18 33.3,18.8 33.3,20.3 34.35,21.35 37.55,21.35 37.97,21.77 U1.31
IO39: length 26.2
  Top Layer w0.3: U1.32 39.24,21.53 38.4,20.7 34.8,20.7 34.2,20.1 34.2,17.4 35.2,16.4 35.2,11.4 36.5,10.1 41.9,10.1 42.2,9.8 R20.2 R19.1
IO40: length 4.6
  Top Layer w0.3: H4.8 38.12,20 38.6,20 40.5,21.91 U1.33
IO41: length 3.7
  Top Layer w0.3: H4.7 41.78,21.11 U1.34
IO42: length 6.8
  Top Layer w0.3: U1.35 43.04,19.84 H4.5
IO47: length 7.3
  Top Layer w0.3: U1.24 31.55,26.7 29,26.7 28.55,26.25 U3.24 27.9,26.74 27.9,28.25 R16.1
IO48: length 7.4
  Top Layer w0.3: U1.25 31.59,25.5 31.25,25.5 ; 31.25,25.5 30.16,24.41 R15.1 ; 31.25,25.5 28.9,25.5 28.65,25.75 U3.23
ISET1: length 1.9
  Top Layer w0.254: R12.2 21.51,10.9 U5.10
ISET2: length 8.9
  Top Layer w0.254: U5.7 19.75,9.75 20.95,8.55 25.95,8.55 27.1,9.7
MODE: length 10.9
  Top Layer w0.254: R8.1 29.2,10 28.6,10.6 27.1,10.6 25.7,9.2 21,9.2 20.25,9.95 U5.8
PG: length 11.6
  Top Layer w0.254: U5.18 17.7,13.71 17.7,14.2 17.2,14.7 15.4,14.7 13.78,13.08 LED6.1
RXEN: length 7.2
  Top Layer w0.3: U2.13 8.94,22.49 R18.2
STAT1: length 4.1
  Top Layer w0.254: U5.2 17.25,8.65 16.79,8.19 LED4.1 16.7,6.88 16.7,6.68
STAT2: length 4.3
  Top Layer w0.254: U5.3 17.75,8.73 LED5.1
TMR: length 10.8
  Top Layer w0.254: U5.14 19.75,14.45 20.1,14.8 27.5,14.8 28.66,15.96 28.66,15.99 28.76,16.09 R10.2
TS: length 3.1
  Top Layer w0.254: R11.2 22.95,13.25 22.4,13.8 20.89,13.8 U5.12
TXEN: length 4.6
  Top Layer w0.3: U2.12 7.54,23.09 R17.2
USB_5V: length 87.8
  Top Layer w0.254: C1.2 22.25,4.5 R5.2 R4.2 16.7,2.05 R6.2
  Top Layer w0.3: 11.6,12 12.7,10.9 12.7,2.94 13.59,2.05 9.75,2.05 7.7,4.1 7.7,9.3 6.93,10.07 J1.B4 ; 11.6,12 13.6,14 13.6,18.5 15.7,20.6 27.2,20.6 27.6,20.2 27.6,18.1 28.4,17.3 31.7,17.3 32.7,16.3 32.7,9 31.6,7.9 31.05,7.9 30.9,8.05 27.5,8.05 ; 11.6,12 U4.5 ; C2.2 C1.2
  Top Layer w0.35: C1.2 22.8,5.1 18.25,9.65 U5.4
USB_D_MINUS: length 2.7
  Top Layer w0.3: U4.3 8.52,11.05 7.5,12.07 J1.A7
USB_D_PLUS: length 2.6
  Top Layer w0.3: 8.93,12.87 8.8,13 8,13 7.57,12.57 J1.A6
VREF: length 2
  Top Layer w0.3: C8.2 16.29,10.7 U5.1
$1N926: length 3.3
  Top Layer w0.3: SW2.2 45.42,12.88 C9.1
$1N1418: length 4.5
  Top Layer w0.254: R2.2 8.75,15.06 7.23,13.54 6.57,13.54 J1.A5
$1N1428: length 4.4
  Top Layer w0.254: J1.B5 6.57,10.6 7.23,10.6 8.75,9.09 R3.2
$1N6564: length 1.7
  Top Layer w0.3: R6.1 13.79,3.57 LED6.2
$1N6603: length 1.7
  Top Layer w0.3: LED5.2 19.69,3.46 R5.1
$1N6642: length 1.7
  Top Layer w0.3: LED4.2 16.79,3.46 R4.1
$1N10209: length 1.9
  Top Layer w0.3: R18.1 5.75,20.8 LED3.2
$1N10210: length 1.9
  Top Layer w0.3: R17.1 5.75,22.8 LED2.2
$1N12425: length 2.8
  Top Layer w0.254: U3.10 23.57,24.73 22.06,24.73 21.26,23.94 C12.1
$1N12673: length 6.3
  Top Layer w0.254: C11.1 29.76,19.94 28.6,21.1 28.6,23.7 28.05,24.25 U3.20
$1N15457: length 2
  Top Layer w0.3: R1.1 40.11,8.85 LED1.2

## Copper pours and planes (outline as drawn; the poured copper is in the pictures)
3.3V on Bottom Layer: 12.1,25.1 2.9,34.3 1,34.3 1,30.7 3.7,28 5.6,28 10.43,22.95 21.65,22.95 22.9,21.7 22.9,20.81 23.96,19.88 29.16,19.88 29.16,17.3 24.8,17.3 24.8,14.4 24.7,14.3 32.5,6.5 38.8,6.5 38.8,11.9 39.1,12.2 39,12.2 38.8,12 38.8,13.06 36.36,13.06 36.2,12.9 36.2,10.83 37.44,9.59 37.44,8.16 37.5,8.1 33.6,8.1 27.28,14.42 27.28,14.7 27.78,15.2 29.91,15.2 29.91,20.19 31.12,20.19 31.1,22.4 27.9,22.4 27.1,21.6 25.25,21.6 25.25,23.09 24.4,23.84 24.4,25.9 40.7,42.5 47.56,42.28 47.56,38.22 48.6,38.22 48.6,42.58 43.58,47.6 41.05,47.6 32.2,37.4 26.1,31 23.7,31 23.6,30.9 23.6,27.35 22.42,27.35 22.42,26.24 23.23,25.25 23.59,24.25 23.59,22.54 22.8,22.59 20.45,25.1
GND on Bottom Layer: 0,41 15.9,41 16,41.1 16,49.9 16.1,50 51,50 51,0.1 50.9,0 0,0

## Text on the board
Bottom Silkscreen Layer: (C)2026 | V1.0
Top Silkscreen Layer: TX | RX | RGB | PG | STAT1 | STAT2 | BOOT | RESET | POWER | 10 | 8 | 18 | 17 | 3V3 | GND | 40 | 42 | 41 | 1 | B+ | B- | 9 | 11 | 13 | 12 | 2 | 14
